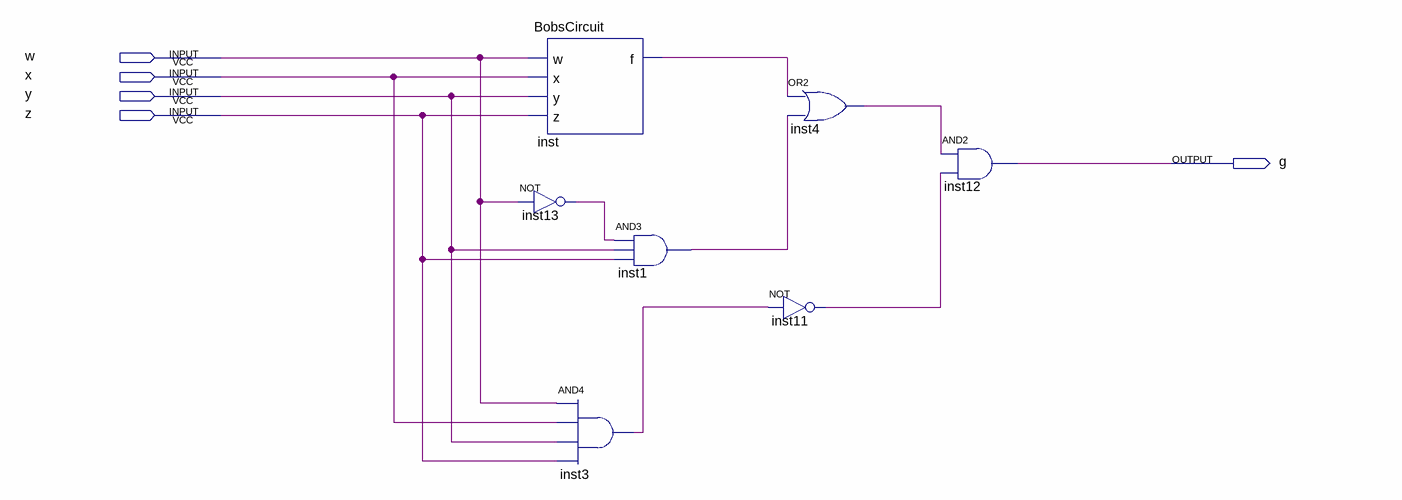
[diagram p0: schematic sheet]
// Quartus schematic correctiveLogic.bdf as structural Verilog: 7 symbols, 5 pins
module correctiveLogic (
  input  w,
  input  x,
  input  y,
  input  z,
  output g
);

  wire inst1_out, inst3_out, inst4_out, inst11_out, inst13_out, inst_f;

  BobsCircuit inst (.w(w), .x(x), .y(y), .z(z), .f(inst_f));
  not inst13 (inst13_out, w);
  and inst3 (inst3_out, w, x, y, z);
  and inst1 (inst1_out, inst13_out, y, z);
  or inst4 (inst4_out, inst_f, inst1_out);
  not inst11 (inst11_out, inst3_out);
  and inst12 (g, inst4_out, inst11_out);
endmodule
